# EAGLE schematic 12T_FULL_BRIDGE (EAGLE 9.1.3)
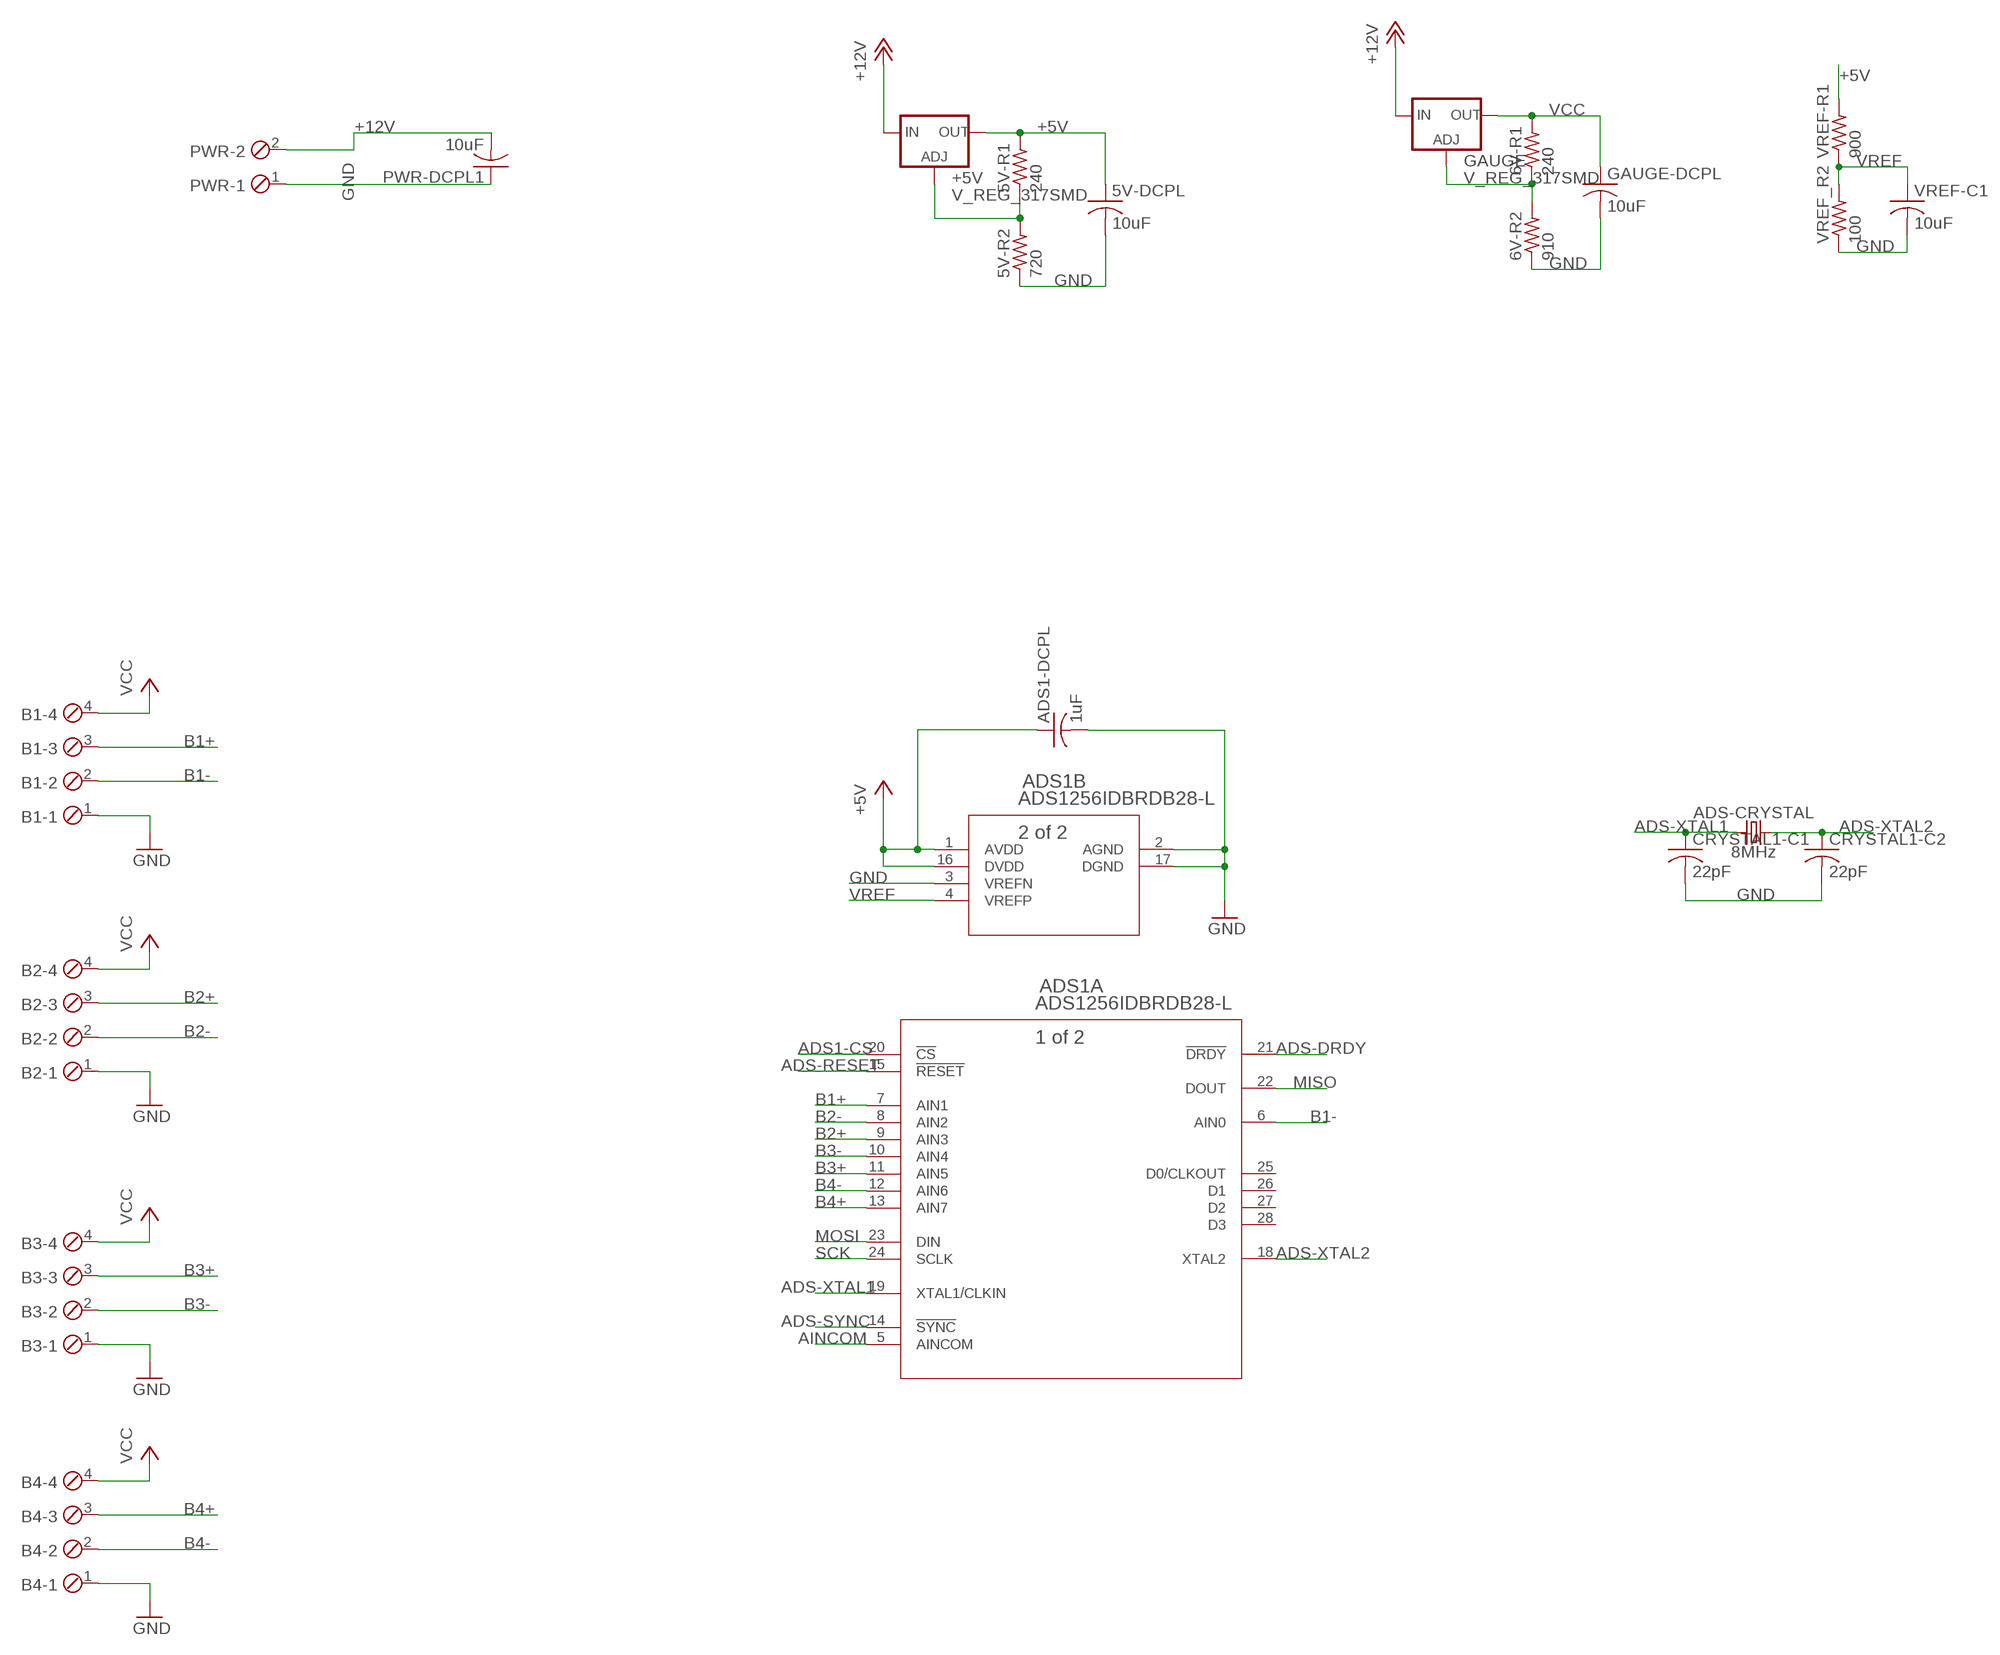
[diagram p0: schematic, sheet 1, part 1 of 2]
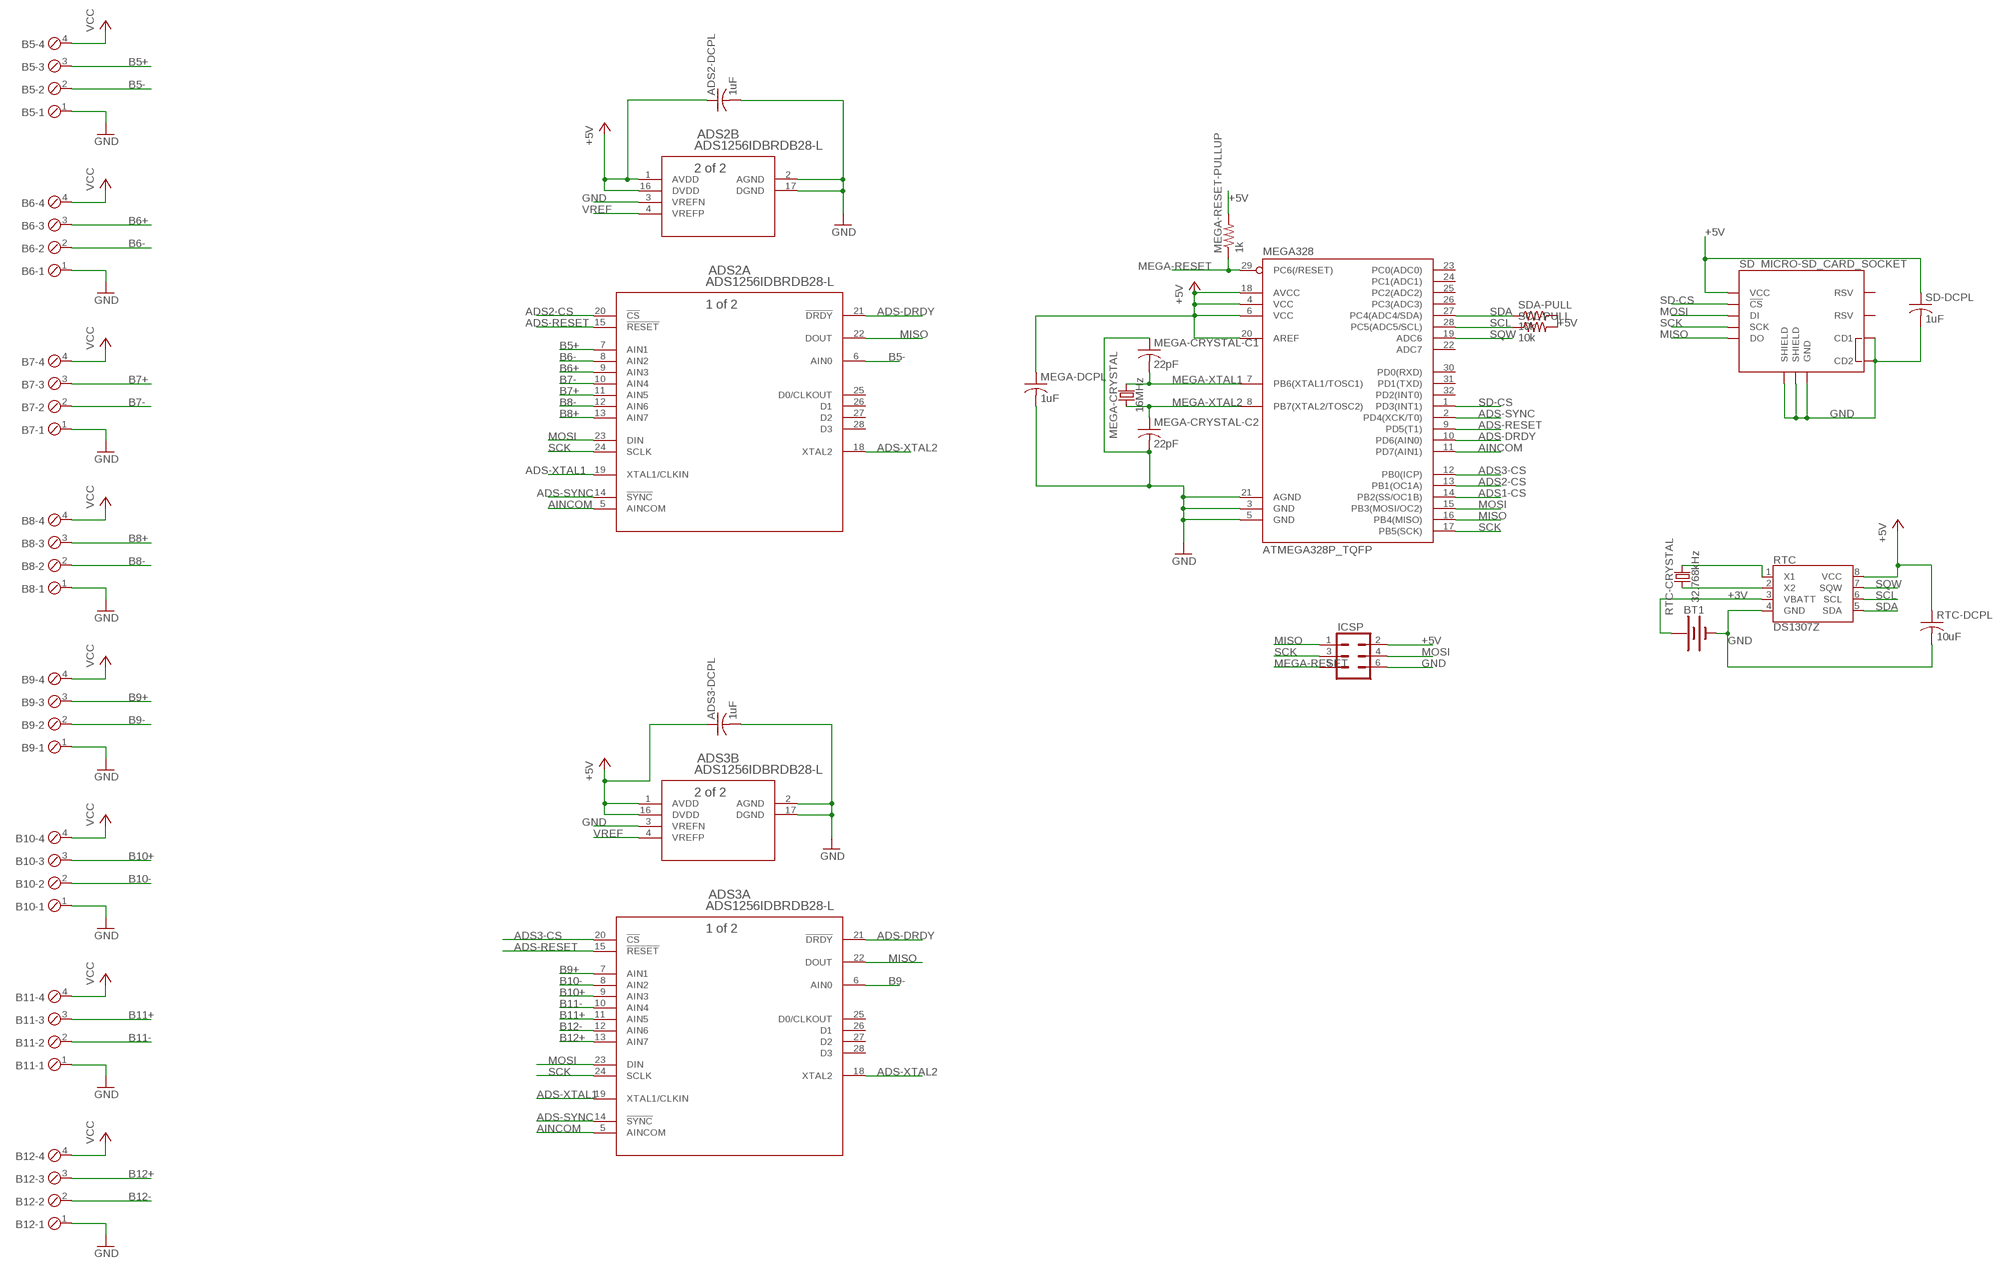
[diagram p1: schematic, sheet 1, part 2 of 2]

## Parts
5V-DCPL  10uF  C-USC1206  [C1206]
5V-R1  240  R-US_R1206  [R1206]
5V-R2  720  R-US_R1206  [R1206]
6V-R1  240  R-US_R1206  [R1206]
6V-R2  910  R-US_R1206  [R1206]
+5V  V_REG_317SMD  [SOT223]
ADS1  ADS1256IDBRDB28-L  [DB28-L]
ADS1-DCPL  1uF  C-USC1206K  [C1206K]
ADS2  ADS1256IDBRDB28-L  [DB28-L]
ADS2-DCPL  1uF  C-USC1206K  [C1206K]
ADS3  ADS1256IDBRDB28-L  [DB28-L]
ADS3-DCPL  1uF  C-USC1206K  [C1206K]
ADS-CRYSTAL  8MHz  CRYSTAL-8MHZSMD-5X3.2  [CRYSTAL-SMD-5X3.2-4PAD]
B1  MPT4  [4POL254]
B2  MPT4  [4POL254]
B3  MPT4  [4POL254]
B4  MPT4  [4POL254]
B5  MPT4  [4POL254]
B6  MPT4  [4POL254]
B7  MPT4  [4POL254]
B8  MPT4  [4POL254]
B9  MPT4  [4POL254]
B10  MPT4  [4POL254]
B11  MPT4  [4POL254]
B12  MPT4  [4POL254]
BT1  BATTERY-12MM_SMD  [BATTCON_12MM]
CRYSTAL1-C1  22pF  C-USC1206  [C1206]
CRYSTAL1-C2  22pF  C-USC1206  [C1206]
GAUGE  V_REG_317SMD  [SOT223]
GAUGE-DCPL  10uF  C-USC1206  [C1206]
ICSP  CONN_03X2FEMALE_SMD  [2X3_SMD]
MEGA328  ATMEGA328P_TQFP  [TQFP32-08]
MEGA-CRYSTAL  16MHz  CRYSTAL-16MHZSMD-5X3.2  [CRYSTAL-SMD-5X3.2-4PAD]
MEGA-CRYSTAL-C1  22pF  C-USC1206K  [C1206K]
MEGA-CRYSTAL-C2  22pF  C-USC1206K  [C1206K]
MEGA-DCPL  1uF  C-USC1206K  [C1206K]
MEGA-RESET-PULLUP  1k  R-US_R1206  [R1206]
PWR  MPT2  [2POL254]
PWR-DCPL1  10uF  C-USC1206  [C1206]
RTC  DS1307Z  [SO08-0.15]
RTC-CRYSTAL  32.768kHz  CRYSTAL-32.768KHZSMD-3.2X1.5  [CRYSTAL-SMD-3.2X1.5MM]
RTC-DCPL  10uF  C-USC1206  [C1206]
SCL-PULL  10k  R-US_R1206  [R1206]
SD  MICRO-SD_CARD_SOCKET  [MICRO-SD-SOCKET]
SD-DCPL  1uF  C-USC1206K  [C1206K]
SDA-PULL  10k  R-US_R1206  [R1206]
VREF-C1  10uF  C-USC1206  [C1206]
VREF-R1  900  R-US_R1206  [R1206]
VREF_R2  100  R-US_R1206  [R1206]

## Nets
+3V: BT1.PWR@1(+) RTC.3(VBATT)
+5V: 5V-DCPL.1 5V-R1.2 +5V.2(OUT) ADS1-DCPL.1 ADS1.1(B:AVDD) ADS1.16(B:DVDD) ADS2-DCPL.1 ADS2.1(B:AVDD) ADS2.16(B:DVDD) ADS3-DCPL.1 ADS3.1(B:AVDD) ADS3.16(B:DVDD) ICSP.2 MEGA328.4(VCC) MEGA328.6(VCC) MEGA328.18(AVCC) MEGA328.20(AREF) MEGA-DCPL.1 MEGA-RESET-PULLUP.2 RTC-DCPL.1 RTC.8(VCC) SCL-PULL.2 SD-DCPL.1 SD.VCC SDA-PULL.2 VREF-R1.2
+12V: +5V.3(IN) GAUGE.3(IN) PWR-DCPL1.2 PWR.2
ADS1-CS: ADS1.20(A:!CS) MEGA328.14(PB2(SS/OC1B))
ADS2-CS: ADS2.20(A:!CS) MEGA328.13(PB1(OC1A))
ADS3-CS: ADS3.20(A:!CS) MEGA328.12(PB0(ICP))
ADS-DRDY: ADS1.21(A:!DRDY) ADS2.21(A:!DRDY) ADS3.21(A:!DRDY) MEGA328.10(PD6(AIN0))
ADS-RESET: ADS1.15(A:!RESET) ADS2.15(A:!RESET) ADS3.15(A:!RESET) MEGA328.9(PD5(T1))
ADS-SYNC: ADS1.14(A:!SYNC) ADS2.14(A:!SYNC) ADS3.14(A:!SYNC) MEGA328.2(PD4(XCK/T0))
ADS-XTAL1: ADS1.19(A:XTAL1/CLKIN) ADS2.19(A:XTAL1/CLKIN) ADS3.19(A:XTAL1/CLKIN) ADS-CRYSTAL.1 CRYSTAL1-C1.1
ADS-XTAL2: ADS1.18(A:XTAL2) ADS2.18(A:XTAL2) ADS3.18(A:XTAL2) ADS-CRYSTAL.3 CRYSTAL1-C2.1
AINCOM: ADS1.5(A:AINCOM) ADS2.5(A:AINCOM) ADS3.5(A:AINCOM) MEGA328.11(PD7(AIN1))
B1+: ADS1.7(A:AIN1) B1.3
B1-: ADS1.6(A:AIN0) B1.2
B2+: ADS1.9(A:AIN3) B2.3
B2-: ADS1.8(A:AIN2) B2.2
B3+: ADS1.11(A:AIN5) B3.3
B3-: ADS1.10(A:AIN4) B3.2
B4+: ADS1.13(A:AIN7) B4.3
B4-: ADS1.12(A:AIN6) B4.2
B5+: ADS2.7(A:AIN1) B5.3
B5-: ADS2.6(A:AIN0) B5.2
B6+: ADS2.9(A:AIN3) B6.3
B6-: ADS2.8(A:AIN2) B6.2
B7+: ADS2.11(A:AIN5) B7.3
B7-: ADS2.10(A:AIN4) B7.2
B8+: ADS2.13(A:AIN7) B8.3
B8-: ADS2.12(A:AIN6) B8.2
B9+: ADS3.7(A:AIN1) B9.3
B9-: ADS3.6(A:AIN0) B9.2
B10+: ADS3.9(A:AIN3) B10.3
B10-: ADS3.8(A:AIN2) B10.2
B11+: ADS3.11(A:AIN5) B11.3
B11-: ADS3.10(A:AIN4) B11.2
B12+: ADS3.13(A:AIN7) B12.3
B12-: ADS3.12(A:AIN6) B12.2
GND: 5V-DCPL.2 5V-R2.1 6V-R2.1 ADS1-DCPL.2 ADS1.2(B:AGND) ADS1.3(B:VREFN) ADS1.17(B:DGND) ADS2-DCPL.2 ADS2.2(B:AGND) ADS2.3(B:VREFN) ADS2.17(B:DGND) ADS3-DCPL.2 ADS3.2(B:AGND) ADS3.3(B:VREFN) ADS3.17(B:DGND) B1.1 B2.1 B3.1 B4.1 B5.1 B6.1 B7.1 B8.1 B9.1 B10.1 B11.1 B12.1 BT1.GND(-) CRYSTAL1-C1.2 CRYSTAL1-C2.2 GAUGE-DCPL.2 ICSP.6 MEGA328.3(GND) MEGA328.5(GND) MEGA328.21(AGND) MEGA-CRYSTAL-C1.1 MEGA-CRYSTAL-C2.2 MEGA-DCPL.2 PWR-DCPL1.1 PWR.1 RTC-DCPL.2 RTC.4(GND) SD-DCPL.2 SD.CD1 SD.CD2 SD.GND SD.GND1(SHIELD) SD.GND3(SHIELD) VREF-C1.2 VREF_R2.1
MEGA-RESET: ICSP.5 MEGA328.29(PC6(/RESET)) MEGA-RESET-PULLUP.1
MEGA-XTAL1: MEGA328.7(PB6(XTAL1/TOSC1)) MEGA-CRYSTAL-C1.2 MEGA-CRYSTAL.3
MEGA-XTAL2: MEGA328.8(PB7(XTAL2/TOSC2)) MEGA-CRYSTAL-C2.1 MEGA-CRYSTAL.1
MISO: ADS1.22(A:DOUT) ADS2.22(A:DOUT) ADS3.22(A:DOUT) ICSP.1 MEGA328.16(PB4(MISO)) SD.DO
MOSI: ADS1.23(A:DIN) ADS2.23(A:DIN) ADS3.23(A:DIN) ICSP.4 MEGA328.15(PB3(MOSI/OC2)) SD.DI
N$5: 5V-R1.1 5V-R2.2 +5V.1(ADJ)
N$11: 6V-R1.1 6V-R2.2 GAUGE.1(ADJ)
N$19: RTC-CRYSTAL.P$2 RTC.1(X1)
N$20: RTC-CRYSTAL.P$1 RTC.2(X2)
SCK: ADS1.24(A:SCLK) ADS2.24(A:SCLK) ADS3.24(A:SCLK) ICSP.3 MEGA328.17(PB5(SCK)) SD.SCLK(SCK)
SCL: MEGA328.28(PC5(ADC5/SCL)) RTC.6(SCL) SCL-PULL.1
SD-CS: MEGA328.1(PD3(INT1)) SD.CS(!CS)
SDA: MEGA328.27(PC4(ADC4/SDA)) RTC.5(SDA) SDA-PULL.1
SQW: MEGA328.19(ADC6) RTC.7(SQW)
VCC: 6V-R1.2 B1.4 B2.4 B3.4 B4.4 B5.4 B6.4 B7.4 B8.4 B9.4 B10.4 B11.4 B12.4 GAUGE-DCPL.1 GAUGE.2(OUT)
VREF: ADS1.4(B:VREFP) ADS2.4(B:VREFP) ADS3.4(B:VREFP) VREF-C1.1 VREF-R1.1 VREF_R2.2
Unconnected: ADS1.25(A:D0/CLKOUT) ADS1.26(A:D1) ADS1.27(A:D2) ADS1.28(A:D3) ADS2.25(A:D0/CLKOUT) ADS2.26(A:D1) ADS2.27(A:D2) ADS2.28(A:D3) ADS3.25(A:D0/CLKOUT) ADS3.26(A:D1) ADS3.27(A:D2) ADS3.28(A:D3) MEGA328.22(ADC7) MEGA328.23(PC0(ADC0)) MEGA328.24(PC1(ADC1)) MEGA328.25(PC2(ADC2)) MEGA328.26(PC3(ADC3)) MEGA328.30(PD0(RXD)) MEGA328.31(PD1(TXD)) MEGA328.32(PD2(INT0)) SD.RSV1(RSV) SD.RSV2(RSV)

## Library data of the parts
5V-DCPL ADS1-DCPL ADS2-DCPL ADS3-DCPL CRYSTAL1-C1 CRYSTAL1-C2 GAUGE-DCPL MEGA-CRYSTAL-C1 MEGA-CRYSTAL-C2 MEGA-DCPL PWR-DCPL1 RTC-DCPL VREF-C1 = rcl:C-US: CAPACITOR, American symbol; SPICEPREFIX: C
5V-R1 5V-R2 6V-R1 6V-R2 MEGA-RESET-PULLUP VREF-R1 VREF_R2 = rcl:R-US_: RESISTOR, American symbol; SPICEPREFIX: R
+5V GAUGE = SparkFun-IC-Power:V_REG_317: Voltage Regulator Standard LM317 adjustable voltage regulator. AOI (Adjust Output Input). Google 'LM317 Calculator' for easy to use app to get the two resistor values needed. 240/720 for 5V output. 240/390 for 3.3V output. Spark Fun Electronics SKU : COM-00527
ADS1-ADS3 = ADS1256:ADS1256IDBR; MANUFACTURER_PART_NUMBER: ADS1256IDBR; VENDOR: Texas Instruments
ADS-CRYSTAL = SparkFun-Clocks:CRYSTAL-8MHZ: 8MHz Crystal Datasheet Example <http://www.futureelectronics.com/en/technologies/electromechanical/timing-devices/crystals/Pages/6008189-ABM3B-8.000MHZ-B2-T.aspx?IM=0> Frequency: 8MHz Frequency Tolerance: ±20ppm Load Capacitance: 18pF SparkFun Products: Pro Micro -3.3V/8MHz <https://www.sparkfun.com/products/12587> WAV Trigger <https://www.sparkfun.com/products/13660>; PROD_ID: XTAL-09431
B1-B12 = con-phoenix-254:MPT4: PHOENIX CONNECTOR; OC_FARNELL: unknown; OC_NEWARK: unknown
BT1 = SparkFun-Batteries:BATTERY: Battery - Single Cell A variety of battery chemistries, sizes, and footprints. Device List: 20MM_PTH - Coin Cell Battery Holder - 20mm (PTH) <https://www.sparkfun.com/products/783> 6.8MM_PTH - Coin Cell Battery Holder - 6.8MM(SMD) <https://www.digikey.com/product-detail/en/seiko-instruments/MS621FE-FL11E/728-1057-ND/1889208?WT.srch=1&gclid=CNOQ5a6LzdQCFZS2wAodXCkE0g> 12MM_SMD - Coin Cell Battery Holder - 12mm (SMD) <https://www.sparkfun.com/products/10592> 12MM_PTH - Coin Cell Battery Holder - 12mm (PTH) <https://www.sparkfun.com/products/7948> 20MM_SMD - 20mm Coin Cell Battery Holder (SMD) (2 legs) Used on the Big Time Watch Kit <https://www.sparkfun.com/products/11734> 20MM_SMD_4LEGS - Coin Cell Battery Holder - 20mm (SMD) <https://www.sparkfun.com/products/11892> 20MM_SMD_4LEGS_OVERPASTE - Coin Cell Battery Holder - 20mm (SMD) <https://www.sparkfun.com/products/11892> (Over-paste on the legs) 24.5MM_PTH - Coin Cell Battery Holder - 24.5mm (PTH) <https://www.sparkfun.com/products/8863> 9V - 9V Battery Holder - PC Mount Used on the SparkFun SparkPunk Sound Kit <https://www.sparkfun.com/products/11177> and SparkFun SparkPunk Sequencer Kit <https://www.sparkfun.com/products/12707> 18650 - Battery Holder - 18650 (PTH) <https://www.sparkfun.com/products/13113> AA - Battery Holder - 1xAA (PTH) <https://www.sparkfun.com/products/7949> AAA - Battery Holder - 1xAAA (PTH) <https://www.sparkfun.com/products/12718> AA_KIT - Battery Holder - 1xAA (PTH) <https://www.sparkfun.com/products/7949> Special kit package - pads only have exposed copper on one side of the board. AAA_KIT - Battery Holder - 1xAAA (PTH) <https://www.sparkfun.com/products/12718> Special kit package - pads only have exposed copper on one side of the board.; PROD_ID: BATT-08044; SF_SKU: PRT-10592
ICSP = SparkFun-Connectors:CONN_03X2: Multi connection point. Often used as Generic Header-pin footprint for 0.1 inch spaced/style header connections You can populate with any combo of single row headers, but if you'd like an exact match, check these: Header - 2x3 (Male, 0.1") <https://www.sparkfun.com/products/12807> (PRT-12807) Header - 2x3 (Female, 0.1") <https://www.sparkfun.com/products/13010> (PRT-13010) 2x3 Pin Shrouded Header <https://www.sparkfun.com/products/10877> (PRT-10877) On any of the 0.1 inch spaced packages, you can populate with these: Break Away Headers - Straight <https://www.sparkfun.com/products/116> (PRT-00116) Break Away Male Headers - Right Angle <https://www.sparkfun.com/products/553> (PRT-00553) Female Headers <https://www.sparkfun.com/products/115> (PRT-00115) Break Away Headers - Machine Pin <https://www.sparkfun.com/products/117> (PRT-00117) Break Away Female Headers - Swiss Machine Pin <https://www.sparkfun.com/products/743> (PRT-00743) Special note: the shrouded connector mates well with our 3x2 ribbon cables: Ribbon Crimp Connector - 6-pin (2x3, Female) <https://www.sparkfun.com/products/10651> (PRT-10651) Ribbon Cable - 6 wire (15ft) <https://www.sparkfun.com/products/10646> (PRT-10646); PROD_ID: CONN-11290
MEGA328 = SparkFun-IC-Microcontroller:ATMEGA328P_TQFP: Popular 328P in QFP Storefront component: ATmega328 - TQFP <https://www.sparkfun.com/products/13448> (COM-13448) Datasheet <http://www.sparkfun.com/datasheets/Components/SMD/ATMega328.pdf> SparkFun Products SparkFun RedBoard - Programmed with Arduino <https://www.sparkfun.com/products/12757> (DEV-12757) Arduino Pro Mini 328 - 5V/16MHz <https://www.sparkfun.com/products/11113> (DEV-11113) Arduino Pro Mini 328 - 3.3V/8MHz <https://www.sparkfun.com/products/11114> (DEV-11114) SparkFun OpenLog <https://www.sparkfun.com/products/13712> (DEV-13712) SparkFun MicroView - OLED Arduino Module <https://www.sparkfun.com/products/12923> (DEV-12923) SparkFun Digital Sandbox <https://www.sparkfun.com/products/12651> (DEV-12651) SparkFun PicoBoard <https://www.sparkfun.com/products/11888> (WIG-11888) Arduino Fio <https://www.sparkfun.com/products/10116> (DEV-10116) LilyPad Arduino 328 Main Board <https://www.sparkfun.com/products/13342> (DEV-13342) SparkFun RedStick <https://www.sparkfun.com/products/13741> (DEV-13741) LilyPad MP3 <https://www.sparkfun.com/products/11013> (DEV-11013) LilyPad Arduino SimpleSnap <https://www.sparkfun.com/products/10941> (DEV-10941) SparkFun Stepoko <https://www.sparkfun.com/products/13899> (ROB-13899) SparkFun Geiger Counter <https://www.sparkfun.com/products/11345> (SEN-11345) SparkFun EL Sequencer <https://www.sparkfun.com/products/12781> (COM-12781) Arduino Pro 328 - 5V/16MHz <https://www.sparkfun.com/products/10915> (DEV-10915) CryptoCape <https://www.sparkfun.com/products/12773> (DEV-12773) SparkFun IR Thermometer Evaluation Board - MLX90614 <https://www.sparkfun.com/products/10740> (SEN-10740) SparkFun RedBot Mainboard <https://www.sparkfun.com/products/12097> (ROB-12097) Arduino Pro 328 - 3.3V/8MHz <https://www.sparkfun.com/products/10914> (DEV-10914) SparkFun Block for Intel® Edison - Arduino <https://www.sparkfun.com/products/13036> (DEV-13036) SparkFun Simon Says - Surface Mount Soldering Kit <https://www.sparkfun.com/products/10935> (KIT-10935) SparkFun 7-Segment Serial Display - Red <https://www.sparkfun.com/products/11441> (COM-11441) SparkFun 7-Segment Serial Display - White <https://www.sparkfun.com/products/11629> (COM-11629) SparkFun 7-Segment Serial Display - Yellow <https://www.sparkfun.com/products/11443> (COM-11443) SparkFun 7-Segment Serial Display - Kelly Green <https://www.sparkfun.com/products/11440> (COM-11440) SparkFun 7-Segment Serial Display - Blue <https://www.sparkfun.com/products/11442> (COM-11442) SparkFun OpenSegment Serial Display - 20mm (Blue) <https://www.sparkfun.com/products/11647> (COM-11647) SparkFun OpenSegment Serial Display - 20mm (Green) <https://www.sparkfun.com/products/11646> (COM-11646) SparkFun OpenSegment Serial Display - 20mm (White) <https://www.sparkfun.com/products/11648> (COM-11648) SparkFun OpenSegment Serial Display - 20mm (Red) <https://www.sparkfun.com/products/11644> (COM-11644) SparkFun OpenSegment Serial Display - 20mm (Yellow) <https://www.sparkfun.com/products/11645> (COM-11645) SparkFun OpenSegment Shield <https://www.sparkfun.com/products/13190> (DEV-13190); PROD_ID: IC-09069
MEGA-CRYSTAL = SparkFun-Clocks:CRYSTAL-16MHZ: 16MHz Crystal Digikey Example <http://www.digikey.com/product-search/en?keywords=535-9122-1-ND> Frequency: 16MHz Frequency Stability: ±50ppm Frequency Tolerance: ±20ppm Load Capacitance: 18pF SparkFun Products: Pro Micro -5V/16MHz <https://www.sparkfun.com/products/12640> SparkFun Serial Enabled LCD Kit <https://www.sparkfun.com/products/10097>; PROD_ID: XTAL-08218; SF_ID: COM-00094
PWR = con-phoenix-254:MPT2: PHOENIX CONNECTOR; OC_FARNELL: unknown; OC_NEWARK: unknown
RTC = SparkFun-Clocks:DS1307: Maxim DS1307 - I2C Real-time clock (RTC) The DS1307 serial real-time clock (RTC) is a low-power, full binary-coded decimal (BCD) clock/calendar plus 56 bytes of NV SRAM. Address and data are transferred serially through an I2C, bidirectional bus. The clock/calendar provides seconds, minutes, hours, day, date, month, and year information. SparkFun Products: Real Time Clock Module <https://www.sparkfun.com/products/12708> (BOB-12708) Datasheet <https://cdn.sparkfun.com/datasheets/BreakoutBoards/DS1307.pdf>; PROD_ID: IC-08138
RTC-CRYSTAL = SparkFun-Clocks:CRYSTAL-32.768KHZ: 32.768kHz Crystal Frequency: 32.768kHz Frequency Stability: ±20ppm Load Capacitance: 12.5pF (PTH-2X6 & SMD-3.2X1.5), 6pF (SMD-2X6) SparkFun Products: SparkFun BigTime Watch Kit <https://www.sparkfun.com/products/11734> SparkFun nRF52832 Breakout <https://www.sparkfun.com/products/13990> SparkFun Real Time Clock Module <https://www.sparkfun.com/products/12708>; PROD_ID: XTAL-13062
SCL-PULL SDA-PULL = resistor:R-US_: RESISTOR, American symbol
SD = SparkFun-Connectors:MICRO-SD_CARD_SOCKET: microSD Socket for Transflash Push-push type µSD socket. tDoc lines correctly indicate media card edge positions when inserting (unlocked, locked, depressed). NOTE: CD1 and CD2 are connected internally, and the default detect state of the socket is detect pin to ground. SparkFun Products: WAV Trigger <https://www.sparkfun.com/products/13660> CAN-Bus Shield <https://www.sparkfun.com/products/13262> SparkFun Level Shifing microSD Breakout <https://www.sparkfun.com/products/13743>; PROD_ID: CONN-07820; SF_ID: PRT-00127
SD-DCPL = resistor:C-US: CAPACITOR, American symbol